# Altium schematic sheet 01_POWER.SchDoc
size A4; SheetNumber: 1; SheetTotal: 3
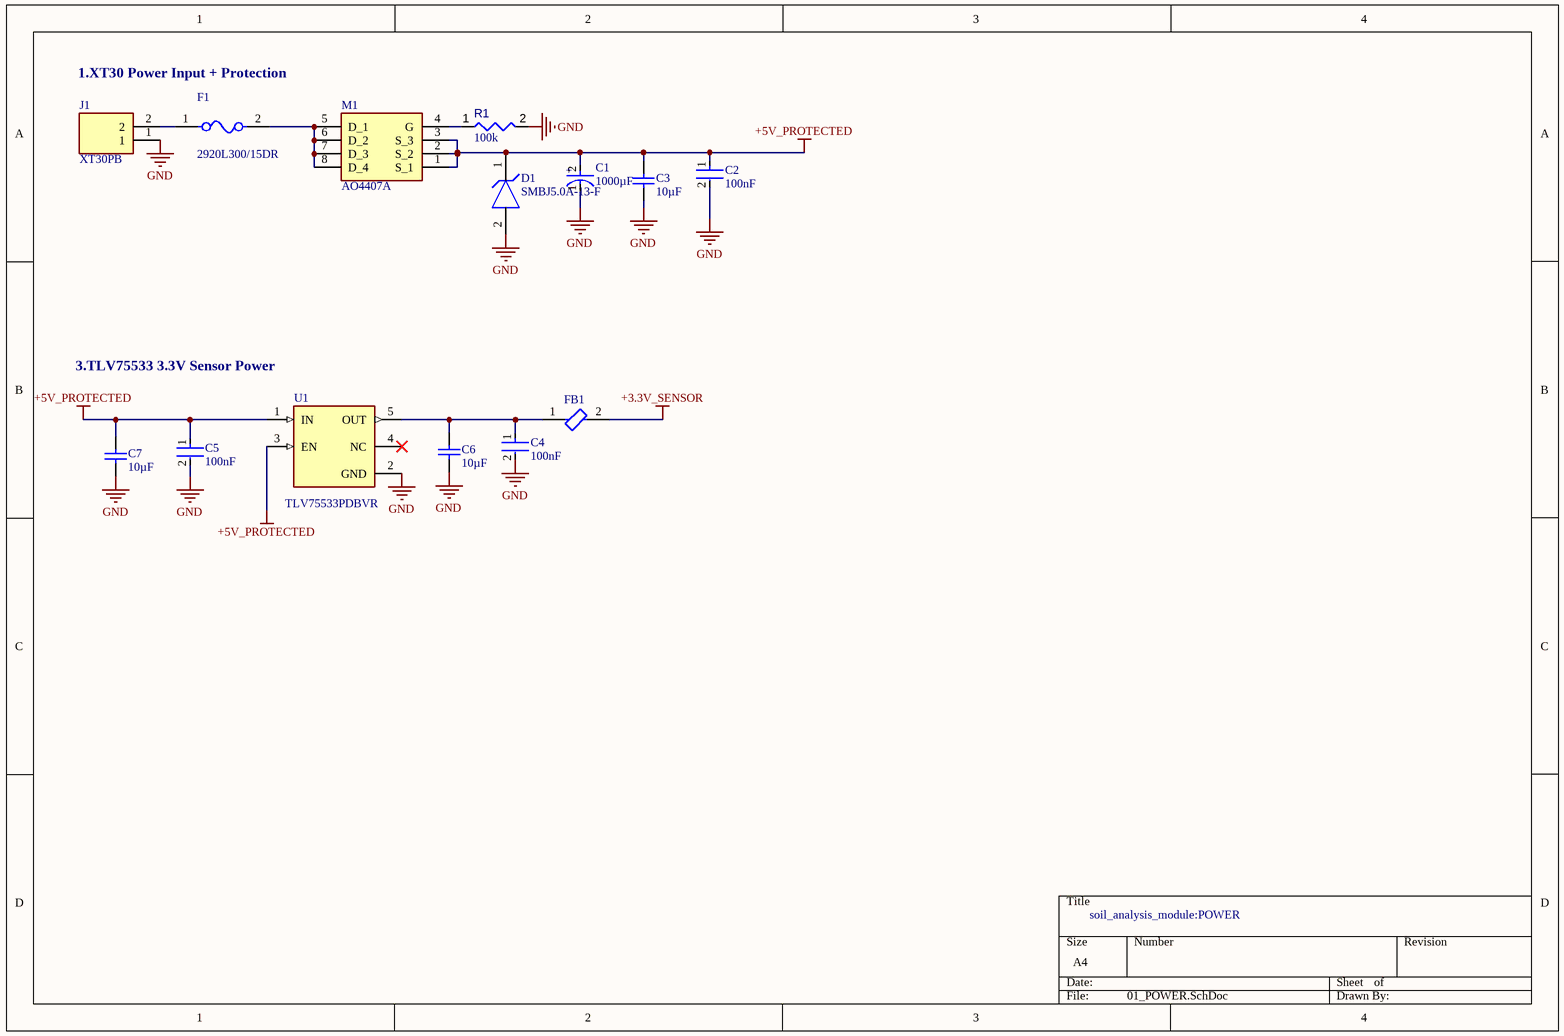
[diagram p0: 01_POWER.SchDoc]

## Parts
C1  value 1000µF  [FP-RAD-TH-D_8_0_5-L_15_1-MFG]  (hidden comment: EEUFR1A102L)
C2  value 100nF  [FP-CC1206-1_25-MFG]  (hidden comment: CC1206KRX7R9BB104)
C3  value 10µF  [CAPC3216X180X55ML20T25]  (hidden comment: GRM31CR71C106KA12L)
C4  value 100nF  [FP-CC1206-1_25-MFG]  (hidden comment: CC1206KRX7R9BB104)
C5  value 100nF  [FP-CC1206-1_25-MFG]  (hidden comment: CC1206KRX7R9BB104)
C6  value 10µF  [CAPC3216X180X55ML20T25]  (hidden comment: GRM31CR71C106KA12L)
C7  value 10µF  [CAPC3216X180X55ML20T25]  (hidden comment: GRM31CR71C106KA12L)
D1  SMBJ5.0A-13-F  [FP-SMB-MFG]
F1  2920L300/15DR  [FP-2920L-MFG]
FB1  BLM31PG121SN1L  [FP-BLM31-0_2-t1_1-MFG]  (value not drawn)
J1  XT30PB  [XT30PB-Footprint-1]
M1  AO4407A  [AO4407A-Footprint-1]
R1  value 100k  [RESC3216X60X45ML15T20]  (hidden comment: Resistor 100k +/-1% 1206 250 mW)
U1  TLV75533PDBVR  [FP-DBV0005A-MFG]

## Nets
+3.3V_SENSOR: FB1.2
+5V_PROTECTED: C1.2(A) C2.1 C3.2 C5.1 C7.2 D1.1(C) M1.1(S_1) M1.2(S_2) M1.3(S_3) U1.1(IN) U1.3(EN)
GND: C1.1(C) C2.2 C3.1 C4.2 C5.2 C6.1 C7.1 D1.2(A) J1.1 R1.2 U1.2(GND)
NetC4_1: C4.1 C6.2 FB1.1 U1.5(OUT)
NetF1_1: F1.1 J1.2
NetF1_2: F1.2 M1.5(D_1) M1.6(D_2) M1.7(D_3) M1.8(D_4)
NetM1_4: M1.4(G) R1.1

Not connected (* = marked no-connect by the designer): U1 4(NC)*

## Notes on the sheet
- 1.XT30 Power Input + Protection
- 3.TLV75533 3.3V Sensor Power
- soil_analysis_module:POWER
- (in symbol CMP-001-00099-1) +

## Library data of the parts
C1 = CMP-001-00099-1: Aluminum Electrolytic Capacitor, 1000 uF, 10 V, ± 20%, 8000 hours @ 105°C, Radial Leaded; Ripple Current (AC): 1.24A; Voltage Rating: 10V; Max Operating Temperature: 105°C; Mounting Technology: PCB, Through Hole; Ripple Current: 1.24A; Case/Package: Radial; Min Operating Temperature: -40°C; Tolerance: 20%; Pins: 2
C2 C4 C5 = CMP-001-00101-1: 50V 100nF X7R ±10% 1206 Multilayer Ceramic Capacitors MLCC - SMD/SMT ROHS; Case/Package: 1206; Tolerance: 10%; Max Operating Temperature: 125°C; Voltage Rating: 50V; Mounting Technology: Surface Mount; Pins: 2; Min Operating Temperature: -55°C
C3 C6 C7 = CMP-001-00100-1: 16V 10uF X7R ±10% 1206 Multilayer Ceramic Capacitors MLCC - SMD/SMT ROHS; Pins: 2; Tolerance: 10%; Voltage Rating: 16V; Mounting Technology: Surface Mount; Max Operating Temperature: 125°C; Min Operating Temperature: -55°C; Case/Package: 1206
D1 = CMP-004-00035-1: SMBJ5.0A Series 600 W 5.0 V Surface Mount Uni-Directional TVS Diode - DO-214AA; Forward Voltage: 5V; Max Surge Current: 65.2A; Pins: 2; Min Operating Temperature: -55°C; Max Operating Temperature: 150°C; Mounting Technology: Surface Mount; Case/Package: SMB
F1 = CMP-005-00015-1: PTC Resettable Fuses; 2920L300/15DR; LITTELFUSE; 5 A; 3 A; 20 s; 2920; Current Rating: 40A; Max Operating Temperature: 85°C; Mounting Technology: Surface Mount; Case/Package: 2920; Min Operating Temperature: -40°C
FB1 = CMP-009-00180-1: Ferrite Beads Multi-Layer 120Ohm 25% 100MHz 3.5A 0.02Ohm DCR 1206 T/R; Case/Package: 1206; Min Operating Temperature: -55°C; Tolerance: 25%; Mounting Technology: Surface Mount; Max Operating Temperature: 125°C
J1 = CMP-002-00071-1: Mini XT60 XT30 Connector for RC Multirotor Racing Drone Quadcopter; Pins: 4
M1 = CMP-013-00036-1: Mosfet P-ch 30V 12A 8SOIC / Trans Mosfet P-ch 30V 12A 8-PIN SOIC; Case/Package: SOIC; Pins: 8; Max Operating Temperature: 150°C; Min Operating Temperature: -55°C; Mounting Technology: Surface Mount
R1 = CMP-009-00025-5: Chip Resistor, 100 KOhm, +/- 1%, 0.25 W, -55 to 155 degC, 1206 (3216 Metric); Voltage Rating: 200V; Power: 250mW; RoHS Compliant: True; Max Operating Temperature: 155°C; Pins: 2; Tolerance: 1%; Mounting Technology: SM; Case/Package: 1206; Min Operating Temperature: -55°C
U1 = CMP-014-00007-1: 500mA high-PSRR low-IQ low-dropout voltage regulator with enable 5-SOT-23 -40 to 125; Max Supply Voltage: 5.5V; Min Supply Voltage: 1.45V; Max Operating Temperature: 125°C; Pins: 5; Case/Package: SOT-23; Min Operating Temperature: -40°C